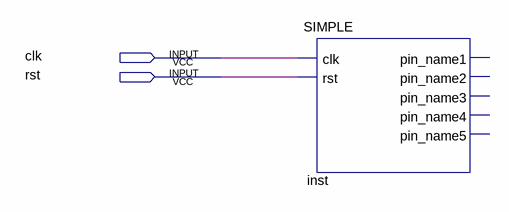
[diagram p0: schematic sheet]
// Quartus schematic SIMPLE.bdf as structural Verilog: 1 symbols, 2 pins
module SIMPLE (
  input  clk,
  input  rst
);

  SIMPLE inst (.clk(clk), .rst(rst));  // open: pin_name1, pin_name2, pin_name3, pin_name4, pin_name5
endmodule
